# EAGLE schematic mega8pin (EAGLE 6.3)
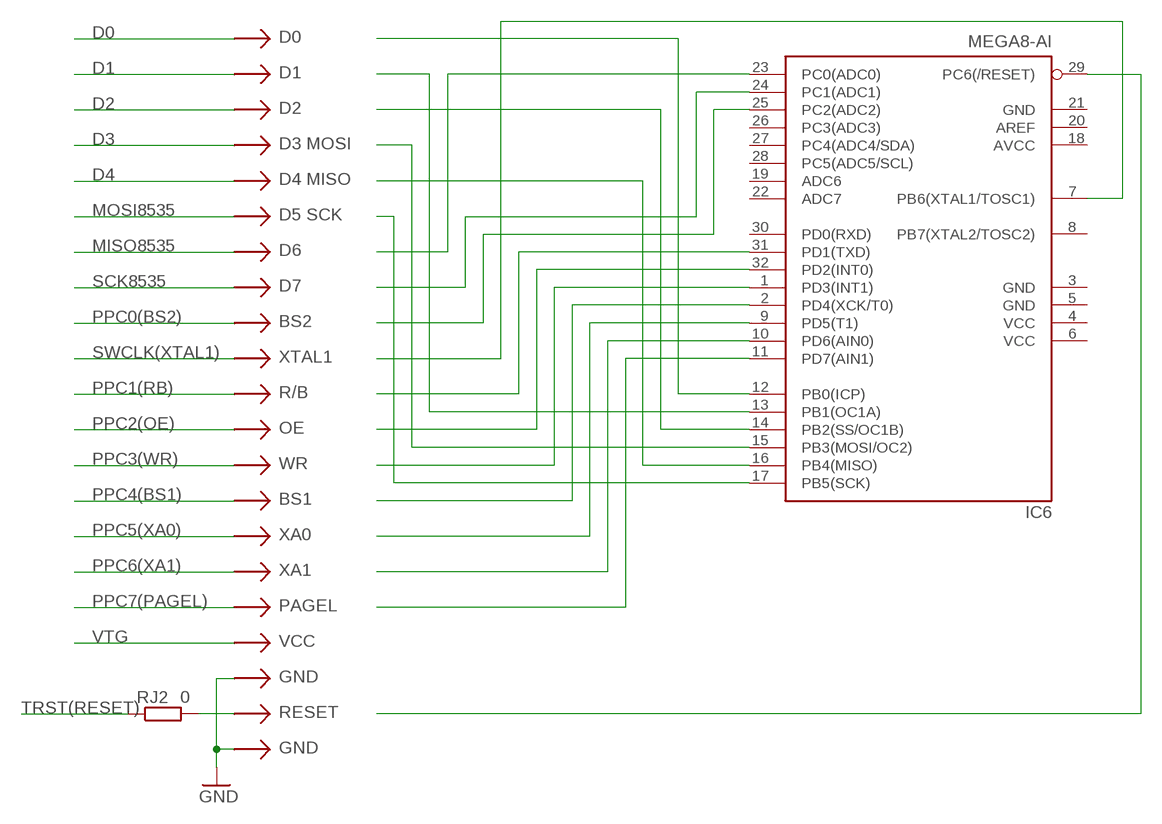
[diagram p0: schematic, sheet 1]

## Parts
IC6  MEGA8-AI  [TQFP32-08]
RJ2  0  R-EU_R1206  [R1206]
X2  P_AVR_P  [P_AVR]

## Nets
D0: X2.D0
D1: X2.D1
D2: X2.D2
D3: X2.D3
D4: X2.D4
GND: X2.GND X2.GND2
MISO8535: X2.D6
MOSI8535: X2.D5
N$1: RJ2.2 X2.RESET
N$16: IC6.12(PB0(ICP))
N$18: IC6.13(PB1(OC1A))
N$19: IC6.14(PB2(SS/OC1B))
N$20: IC6.15(PB3(MOSI/OC2))
N$21: IC6.16(PB4(MISO))
N$22: IC6.17(PB5(SCK))
N$23: IC6.23(PC0(ADC0))
N$24: IC6.24(PC1(ADC1))
N$25: IC6.25(PC2(ADC2))
N$26: IC6.7(PB6(XTAL1/TOSC1))
N$27: IC6.31(PD1(TXD))
N$28: IC6.32(PD2(INT0))
N$29: IC6.1(PD3(INT1))
N$30: IC6.2(PD4(XCK/T0))
N$31: IC6.9(PD5(T1))
N$40: IC6.10(PD6(AIN0))
N$50: IC6.11(PD7(AIN1))
N$51: IC6.29(PC6(/RESET))
PPC0(BS2): X2.BS2
PPC1(RB): X2.RB
PPC2(OE): X2.OE
PPC3(WR): X2.WR
PPC4(BS1): X2.BS1
PPC5(XA0): X2.XA0
PPC6(XA1): X2.XA1
PPC7(PAGEL): X2.PAGEL
SCK8535: X2.D7
SWCLK(XTAL1): X2.XTAL1
TRST(RESET): RJ2.1
VTG: X2.VCC
Unconnected: IC6.8(PB7(XTAL2/TOSC2)) IC6.19(ADC6) IC6.20(AREF) IC6.22(ADC7) IC6.26(PC3(ADC3)) IC6.27(PC4(ADC4/SDA)) IC6.28(PC5(ADC5/SCL)) IC6.30(PD0(RXD))

## Power pins joined to a net without a drawn wire
AVCC: IC6.18(AVCC)
GND: IC6.3(GND) IC6.5(GND) IC6.21(GND)
VCC: IC6.4(VCC) IC6.6(VCC)

## Library data of the parts
IC6 = atmel:MEGA8: MICROCONTROLLER 8 Kbytes FLASH, 1 kbytes SRAM, 512 bytes EEPROM, USART, 6-channel 10 bit ADC, 2-channel 8 bit ADC Pin compatible with Atmega48, ATMega88, ATMega168 Source: avr.lbr; MPN: ATMEGA8-16AU; OC_FARNELL: 9171371; OC_NEWARK: 73M8863
RJ2 = rcl:R-EU_: RESISTOR, European symbol
X2 = Programmer:P_AVR